# EasyEDA schematic SCH_ATOM-Sumo_2026-06-13.json
TITLE: ATOM SUMO; REV: 1.0; Date: 2026-02-04; Sheet: 1/1; Drawn By: Jevgeni Gandšu; Company: Tartu ülikool
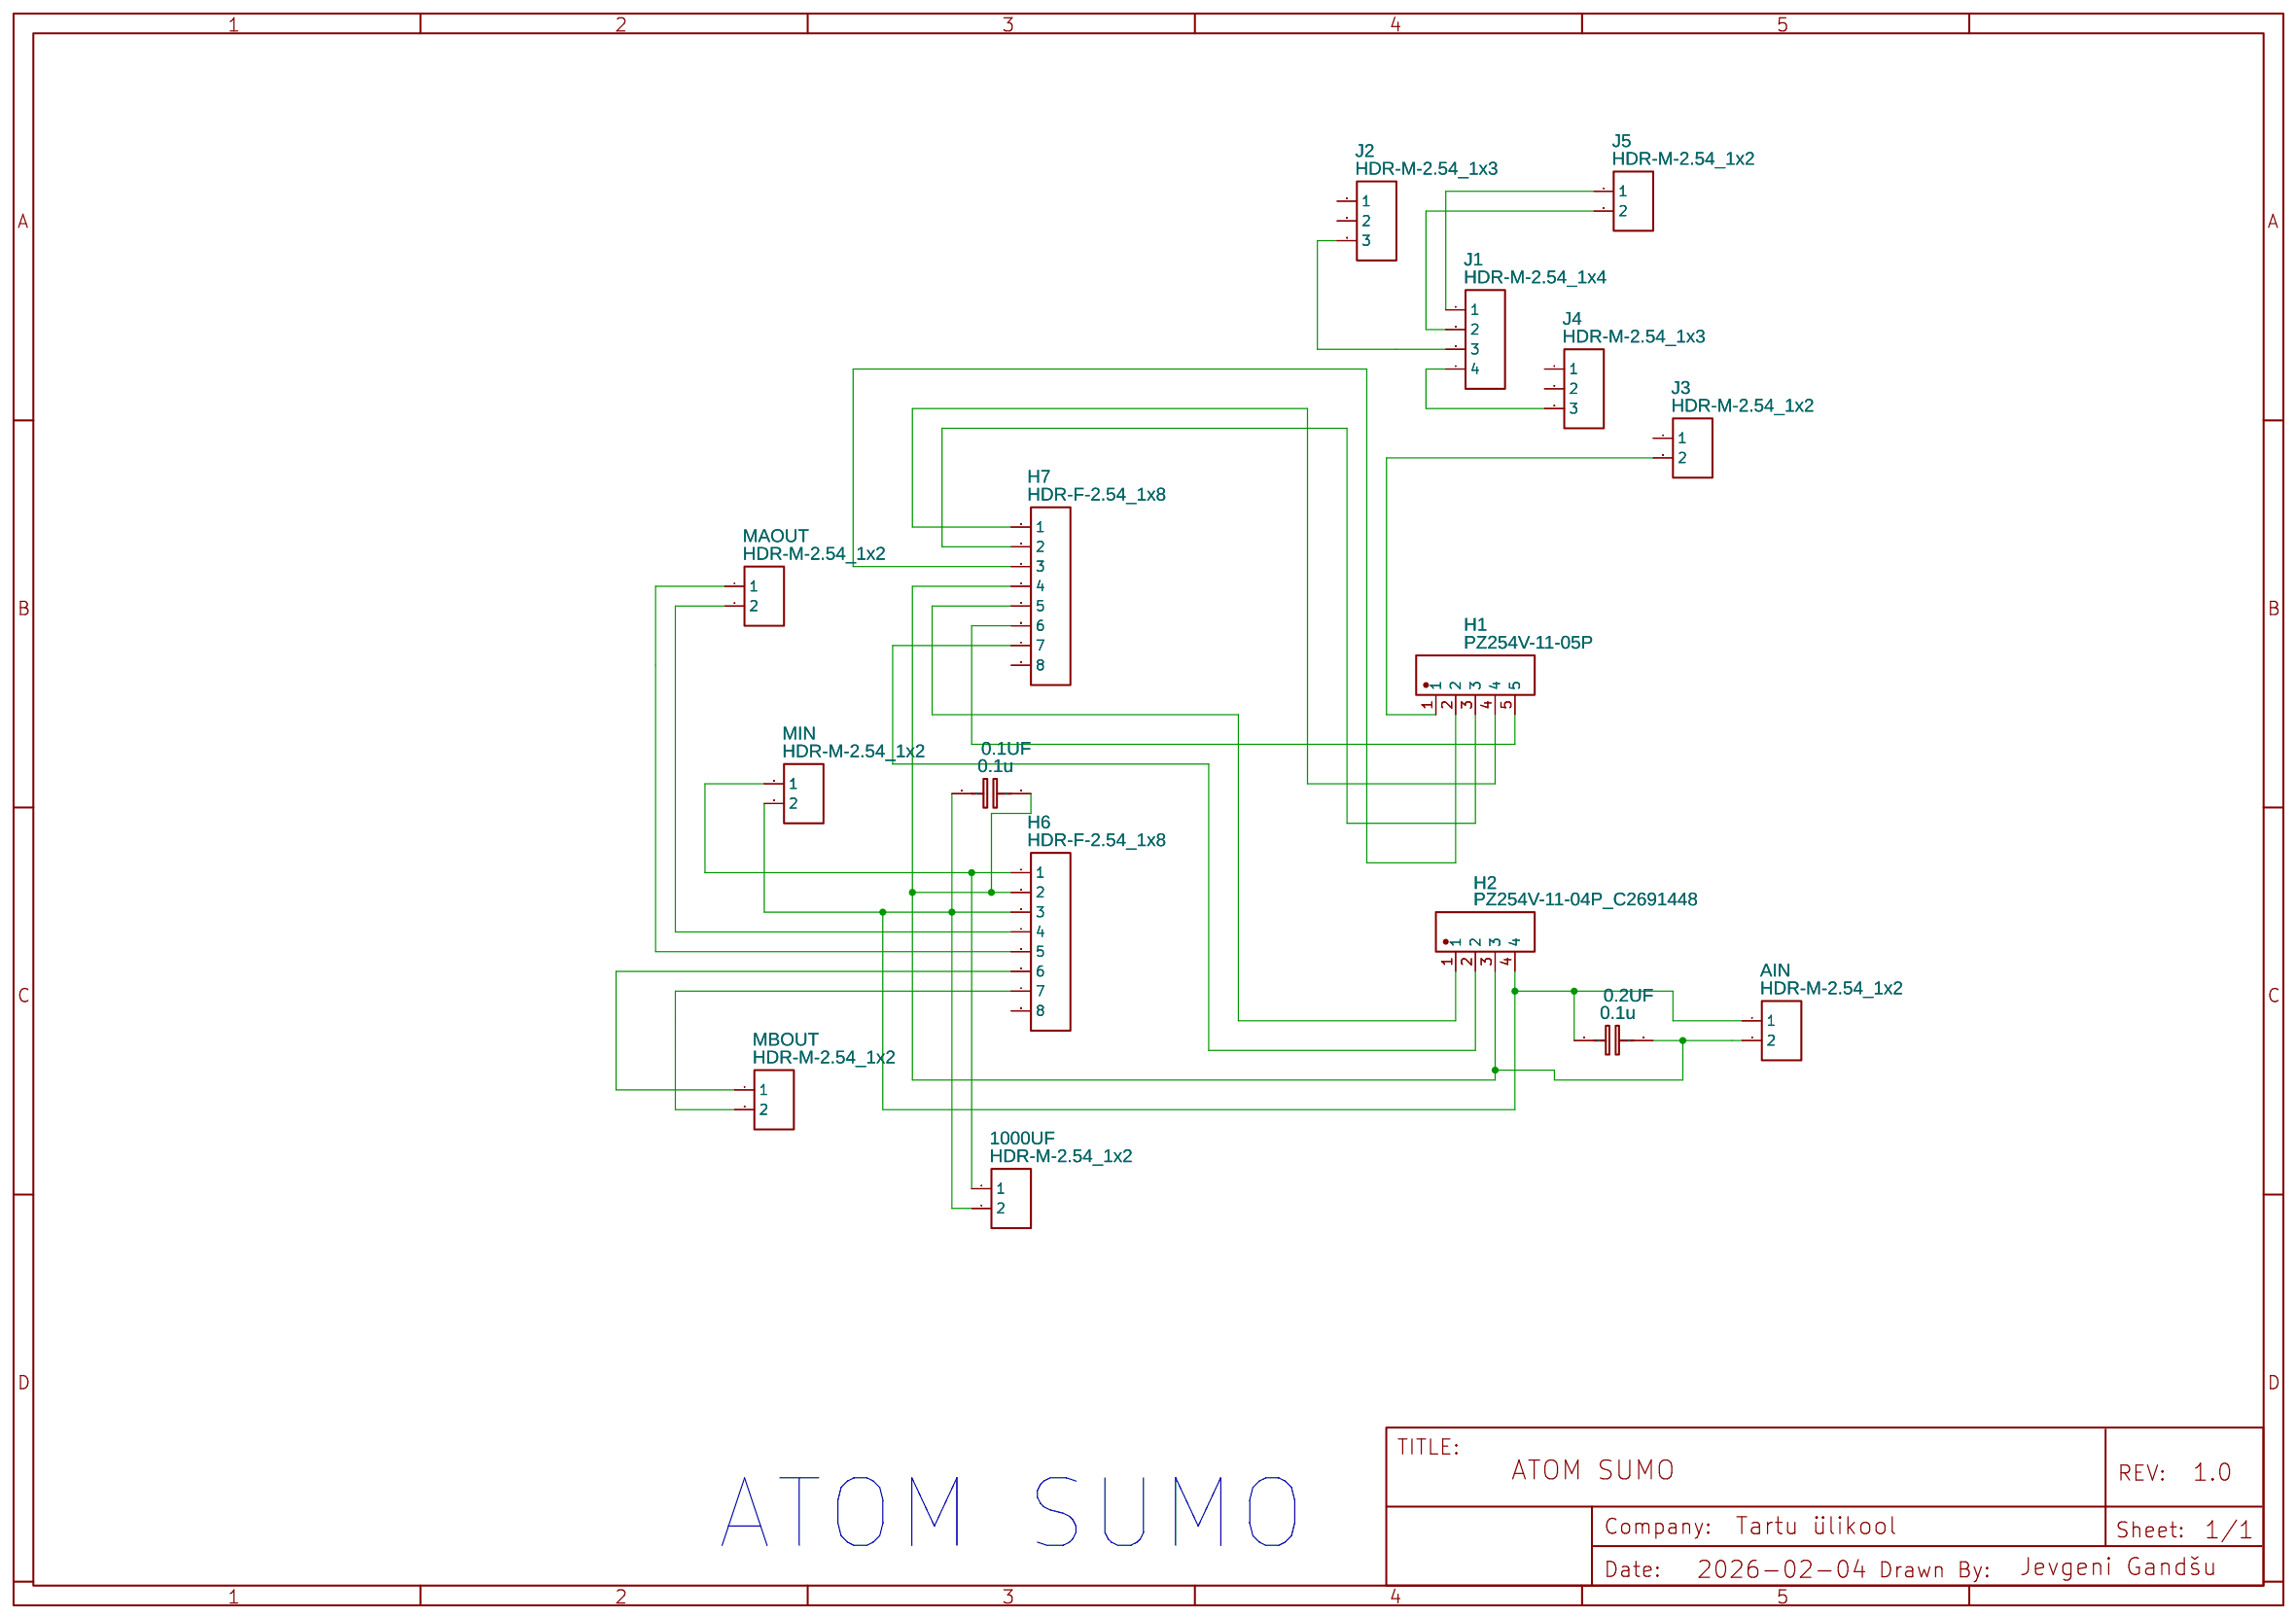
[diagram p0: schematic sheet]

## Parts
0.1UF  0.1u  [C0805]
0.2UF  0.1u  [C0805]
1000UF  HDR-M-2.54_1x2  [HDR-M-2.54_1X2]
AIN  HDR-M-2.54_1x2  [HDR-M-2.54_1X2]
H1  PZ254V-11-05P  [HDR-TH_5P-P2.54-V-M]
H2  PZ254V-11-04P_C2691448  [HDR-TH_4P-P2.54-V-M]
H6  HDR-F-2.54_1x8  [HDR-F-2.54_1X8]
H7  HDR-F-2.54_1x8  [HDR-F-2.54_1X8]
J1  HDR-M-2.54_1x4  [HDR-M-2.54_1X4]
J2  HDR-M-2.54_1x3  [HDR-M-2.54_1X3]
J3  HDR-M-2.54_1x2  [HDR-M-2.54_1X2]
J4  HDR-M-2.54_1x3  [HDR-M-2.54_1X3]
J5  HDR-M-2.54_1x2  [HDR-M-2.54_1X2]
MAOUT  HDR-M-2.54_1x2  [HDR-M-2.54_1X2]
MBOUT  HDR-M-2.54_1x2  [HDR-M-2.54_1X2]
MIN  HDR-M-2.54_1x2  [HDR-M-2.54_1X2]

## Library data of the parts
0.1UF 0.2UF = C_0805_EU: Contributor: LCEDA_Lib
1000UF AIN J3 J5 MAOUT MBOUT MIN = HDR-M-2.54_1x2: Supplier Part: C124375; Supplier: LCSC; Contributor: LCEDA_Lib
H1 = PZ254V-11-05P: Contributor: LCSC; Supplier: LCSC; Supplier Part: C492404; Manufacturer: XFCN(兴飞); JLCPCB Part Class: Extended Part
H2 = PZ254V-11-04P_C2691448: Contributor: LCSC; Supplier: LCSC; Supplier Part: C2691448; Manufacturer: XFCN(兴飞); Manufacturer Part: PZ254V-11-04P; JLCPCB Part Class: Extended Part
H6 H7 = HDR-F-2.54_1x8: Supplier Part: C225505; Supplier: LCSC; Contributor: LCEDA_Lib
J1 = HDR-M-2.54_1x4: Supplier Part: C124378; Supplier: LCSC; Contributor: LCEDA_Lib
J2 J4 = HDR-M-2.54_1x3: Supplier Part: C180248; Supplier: LCSC; Contributor: LCEDA_Lib

## Nets
Net-(0.1UF-1): 0.1UF.1 0.2UF.1 1000UF.2 AIN.1 H2.4 H6.3 MIN.2
Net-(0.1UF-2): 0.1UF.2 0.2UF.2 AIN.2 H2.3 H6.2 H7.4
Net-(1000UF-1): 1000UF.1 H6.1 MIN.1
Net-(H1-1): H1.1 J3.2
Net-(H1-2): H1.2 H7.3
Net-(H1-3): H1.3 H7.2
Net-(H1-4): H1.4 H7.1
Net-(H1-5): H1.5 H7.6
Net-(H2-1): H2.1 H7.5
Net-(H2-2): H2.2 H7.7
Net-(H6-4): H6.4 MAOUT.2
Net-(H6-5): H6.5 MAOUT.1
Net-(H6-6): H6.6 MBOUT.1
Net-(H6-7): H6.7 MBOUT.2
Net-(J1-1): J1.1 J5.1
Net-(J1-2): J1.2 J5.2
Net-(J1-3): J1.3 J2.3
Net-(J1-4): J1.4 J4.3

Not connected (* = marked no-connect by the designer): H6 8; H7 8; J2 1 2; J3 1; J4 1 2

## Notes on the sheet
- ATOM SUMO
